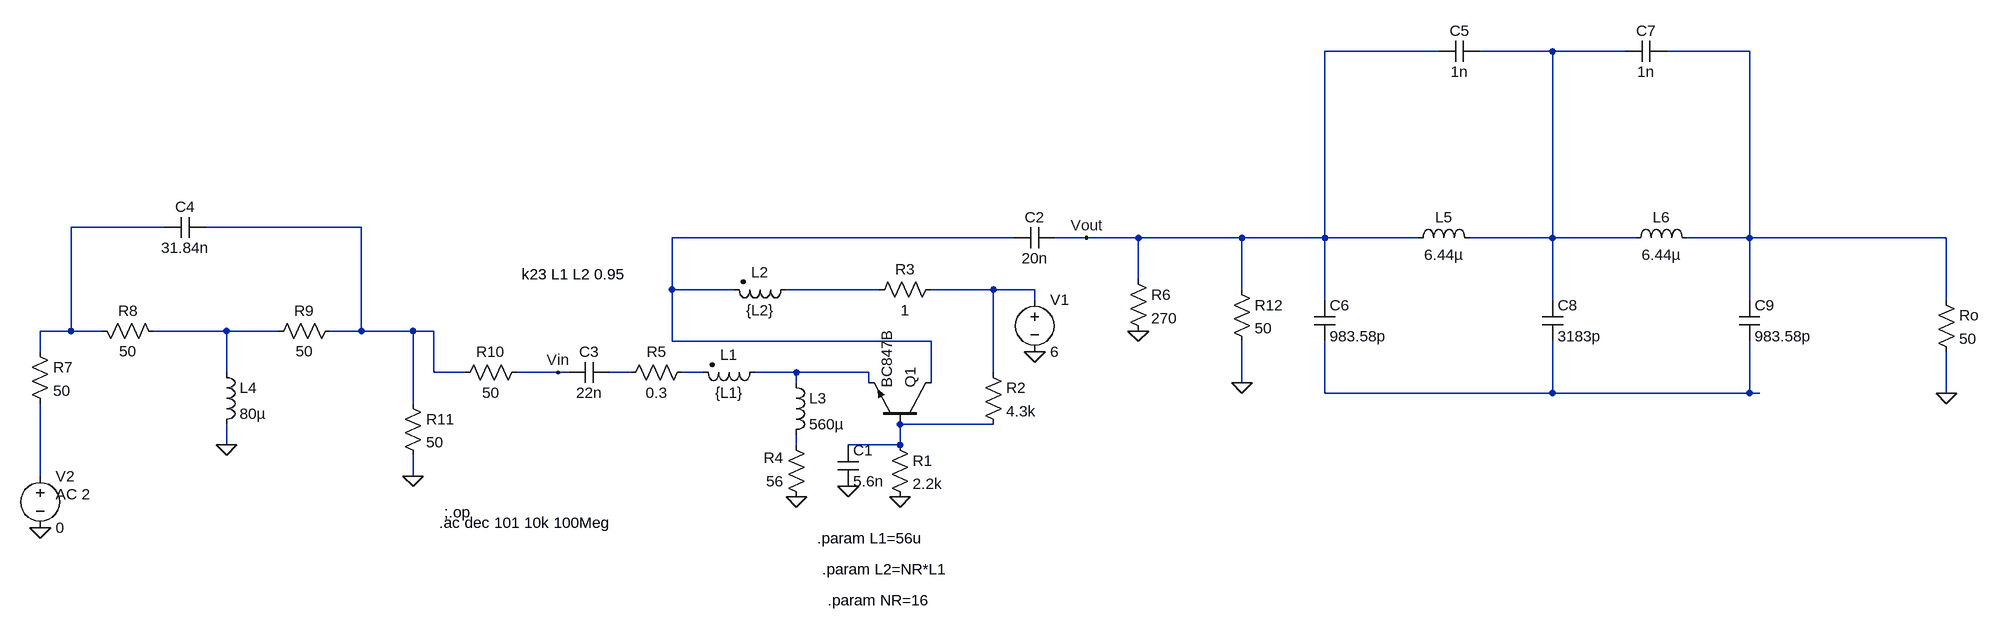
[diagram p0: schematic Combined Circuit.asc]
Combined Circuit.asc, the LTspice schematic file:
Version 4
SHEET 1 1908 680
WIRE 1056 -848 880 -848
WIRE 1232 -848 1120 -848
WIRE 1344 -848 1232 -848
WIRE 1536 -848 1408 -848
WIRE -912 -576 -1056 -576
WIRE -608 -576 -848 -576
WIRE 400 -560 -128 -560
WIRE 512 -560 464 -560
WIRE 592 -560 512 -560
WIRE 752 -560 592 -560
WIRE 880 -560 880 -848
WIRE 880 -560 752 -560
WIRE 1024 -560 880 -560
WIRE 1232 -560 1232 -848
WIRE 1232 -560 1104 -560
WIRE 1360 -560 1232 -560
WIRE 1536 -560 1536 -848
WIRE 1536 -560 1440 -560
WIRE 1840 -560 1536 -560
WIRE 592 -496 592 -560
WIRE -128 -480 -128 -560
WIRE -32 -480 -128 -480
WIRE 192 -480 48 -480
WIRE 368 -480 272 -480
WIRE 432 -480 368 -480
WIRE 752 -480 752 -560
WIRE 432 -464 432 -480
WIRE 880 -464 880 -560
WIRE 1232 -464 1232 -560
WIRE 1536 -464 1536 -560
WIRE 1840 -464 1840 -560
WIRE -1056 -416 -1056 -576
WIRE -1056 -416 -1104 -416
WIRE -1008 -416 -1056 -416
WIRE -816 -416 -928 -416
WIRE -736 -416 -816 -416
WIRE -608 -416 -608 -576
WIRE -608 -416 -656 -416
WIRE -528 -416 -608 -416
WIRE -496 -416 -528 -416
WIRE -128 -400 -128 -480
WIRE 272 -400 -128 -400
WIRE -1104 -384 -1104 -416
WIRE -816 -352 -816 -416
WIRE -496 -352 -496 -416
WIRE -448 -352 -496 -352
WIRE -304 -352 -368 -352
WIRE -288 -352 -304 -352
WIRE -192 -352 -224 -352
WIRE -80 -352 -112 -352
WIRE 64 -352 0 -352
WIRE 176 -352 64 -352
WIRE 368 -352 368 -480
WIRE 64 -336 64 -352
WIRE 176 -336 176 -352
WIRE 272 -336 272 -400
WIRE 752 -336 752 -400
WIRE 880 -320 880 -400
WIRE 1232 -320 1232 -400
WIRE 1232 -320 880 -320
WIRE 1536 -320 1536 -400
WIRE 1536 -320 1232 -320
WIRE 1552 -320 1536 -320
WIRE 1840 -320 1840 -384
WIRE -528 -304 -528 -416
WIRE 368 -272 224 -272
WIRE -816 -240 -816 -272
WIRE 64 -240 64 -256
WIRE 224 -240 224 -272
WIRE 224 -240 144 -240
WIRE -1104 -192 -1104 -304
WIRE -528 -192 -528 -224
FLAG -1104 -112 0
FLAG 64 -160 0
FLAG 144 -176 0
FLAG 224 -160 0
FLAG 432 -384 0
FLAG 592 -416 0
FLAG 512 -560 Vout
FLAG -304 -352 Vin
FLAG -816 -240 0
FLAG -528 -192 0
FLAG 1840 -320 0
FLAG 752 -336 0
SYMBOL npn 272 -272 M270
SYMATTR InstName Q1
SYMATTR Value BC847B
SYMBOL res 208 -256 R0
SYMATTR InstName R1
SYMATTR Value 2.2k
SYMBOL res 352 -368 R0
SYMATTR InstName R2
SYMATTR Value 4.3k
SYMBOL res 288 -496 R90
WINDOW 0 0 56 VBottom 2
WINDOW 3 32 56 VTop 2
SYMATTR InstName R3
SYMATTR Value 1
SYMBOL res 80 -144 R180
WINDOW 0 36 76 Left 2
WINDOW 3 36 40 Left 2
SYMATTR InstName R4
SYMATTR Value 56
SYMBOL res -208 -336 R270
WINDOW 0 32 56 VTop 2
WINDOW 3 0 56 VBottom 2
SYMATTR InstName R5
SYMATTR Value 0.3
SYMBOL res 576 -512 R0
SYMATTR InstName R6
SYMATTR Value 270
SYMBOL cap 128 -240 R0
SYMATTR InstName C1
SYMATTR Value 5.6n
SYMBOL cap 464 -576 R90
WINDOW 0 0 32 VBottom 2
WINDOW 3 32 32 VTop 2
SYMATTR InstName C2
SYMATTR Value 20n
SYMBOL cap -224 -368 R90
WINDOW 0 0 32 VBottom 2
WINDOW 3 32 32 VTop 2
SYMATTR InstName C3
SYMATTR Value 22n
SYMBOL ind2 16 -368 R90
WINDOW 0 4 56 VBottom 2
WINDOW 3 32 56 VTop 2
SYMATTR InstName L1
SYMATTR Value {L1}
SYMATTR Type ind
SYMBOL ind2 64 -496 R90
WINDOW 0 5 56 VBottom 2
WINDOW 3 32 56 VTop 2
SYMATTR InstName L2
SYMATTR Value {L2}
SYMATTR Type ind
SYMBOL voltage 432 -480 R0
SYMATTR InstName V1
SYMATTR Value 6
SYMBOL voltage -1104 -208 R0
WINDOW 123 24 44 Left 2
WINDOW 39 0 0 Left 0
SYMATTR Value2 AC 2
SYMATTR InstName V2
SYMATTR Value 0
SYMBOL ind 48 -352 R0
SYMATTR InstName L3
SYMATTR Value 560µ
SYMBOL res -1120 -400 R0
SYMATTR InstName R7
SYMATTR Value 50
SYMBOL res -1024 -432 M90
WINDOW 0 0 56 VBottom 2
WINDOW 3 32 56 VTop 2
SYMATTR InstName R8
SYMATTR Value 50
SYMBOL ind -832 -368 R0
SYMATTR InstName L4
SYMATTR Value 80µ
SYMBOL cap -848 -592 R90
WINDOW 0 0 32 VBottom 2
WINDOW 3 32 32 VTop 2
SYMATTR InstName C4
SYMATTR Value 31.84n
SYMBOL res -640 -432 R90
WINDOW 0 0 56 VBottom 2
WINDOW 3 32 56 VTop 2
SYMATTR InstName R9
SYMATTR Value 50
SYMBOL res -352 -368 R90
WINDOW 0 0 56 VBottom 2
WINDOW 3 32 56 VTop 2
SYMATTR InstName R10
SYMATTR Value 50
SYMBOL res -544 -320 R0
SYMATTR InstName R11
SYMATTR Value 50
SYMBOL cap 1120 -864 R90
WINDOW 0 0 32 VBottom 2
WINDOW 3 32 32 VTop 2
SYMATTR InstName C5
SYMATTR Value 1n
SYMBOL cap 864 -464 R0
SYMATTR InstName C6
SYMATTR Value 983.58p
SYMBOL ind 1008 -544 R270
WINDOW 0 32 56 VTop 2
WINDOW 3 5 56 VBottom 2
SYMATTR InstName L5
SYMATTR Value 6.44µ
SYMBOL cap 1408 -864 R90
WINDOW 0 0 32 VBottom 2
WINDOW 3 32 32 VTop 2
SYMATTR InstName C7
SYMATTR Value 1n
SYMBOL ind 1344 -544 R270
WINDOW 0 32 56 VTop 2
WINDOW 3 5 56 VBottom 2
SYMATTR InstName L6
SYMATTR Value 6.44µ
SYMBOL cap 1216 -464 R0
SYMATTR InstName C8
SYMATTR Value 3183p
SYMBOL cap 1520 -464 R0
SYMATTR InstName C9
SYMATTR Value 983.58p
SYMBOL res 1824 -480 R0
SYMATTR InstName Ro
SYMATTR Value 50
SYMBOL res 736 -496 R0
SYMATTR InstName R12
SYMATTR Value 50
TEXT -480 -136 Left 2 !;.op
TEXT -488 -120 Left 2 !.ac dec 101 10k 100Meg
TEXT -360 -504 Left 2 !k23 L1 L2 0.95
TEXT 96 -96 Left 2 !.param L1=56u
TEXT 104 -48 Left 2 !.param L2=NR*L1
TEXT 112 0 Left 2 !.param NR=16

The netlist it stands for:
* Combined Circuit.asc
Q1 N005 N013 N011 0 BC847B
R1 N013 0 2.2k
R2 N007 N013 4.3k
R3 N007 N006 1
R4 0 N014 56
R5 N009 N010 0.3
R6 Vout 0 270
C1 N013 0 5.6n
C2 Vout N005 20n
C3 N009 Vin 22n
L1 N011 N010 {L1}
L2 N006 N005 {L2}
V1 N007 0 6
V2 N015 0 0 AC 2
L3 N011 N014 560µ
R7 N003 N015 50
R8 N003 N008 50
L4 N008 0 80µ
C4 N004 N003 31.84n
R9 N004 N008 50
R10 Vin N004 50
R11 N004 0 50
C5 N001 Vout 1n
C6 Vout N012 983.58p
L5 Vout N001 6.44µ
C7 N002 N001 1n
L6 N001 N002 6.44µ
C8 N001 N012 3183p
C9 N002 N012 983.58p
Ro N002 0 50
R12 Vout 0 50
.model NPN NPN
.model PNP PNP
.lib standard.bjt
;.op
.ac dec 101 10k 100Meg
k23 L1 L2 0.95
.param L1=56u
.param L2=NR*L1
.param NR=16
.backanno
.end

* Results of the author's LTspice run, read from the files saved beside the schematic
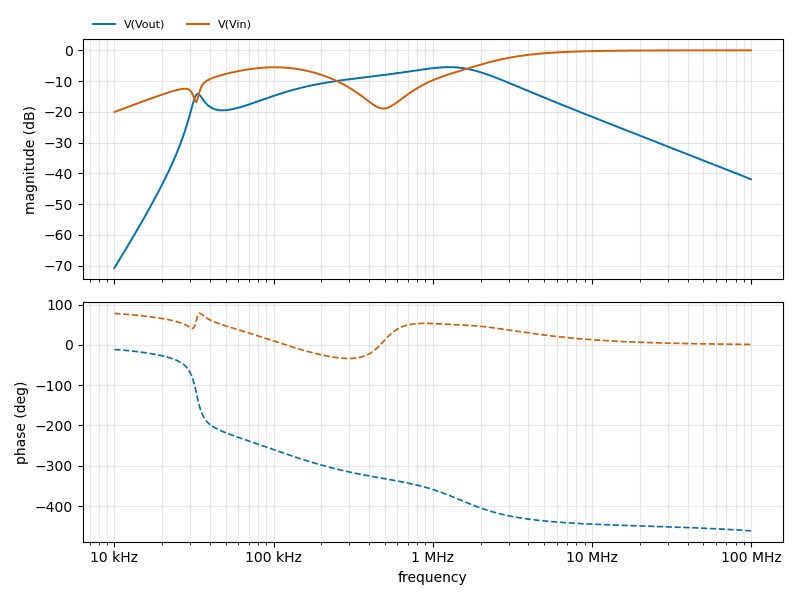
[diagram p1: AC Analysis of Combined Circuit.asc, plotted from the saved traces]
* AC Analysis, 1 run:
*   V(Vout): -70.83 dB at 10 kHz, -41.95 dB at 100 MHz, peak -5.47 dB at 1.256 MHz, 3 dB below the peak at 419.9 kHz and 2.381 MHz
*   V(Vin): -20.07 dB at 10 kHz, -0.00 dB at 100 MHz, peak -0.00 dB at 100 MHz, 3 dB below the peak at 2.658 MHz